# Altium schematic sheet DHT111_DHT11.schdoc
size 124 x 99 mm
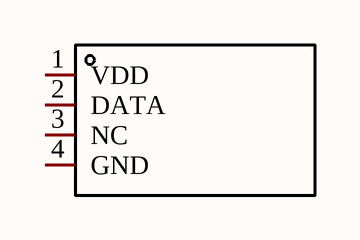
[diagram p0: DHT111_DHT11.schdoc]

## Parts
U?  DHT11  [SENSOR-TH_DHT11]  (value not drawn)

## Nets

Not connected (* = marked no-connect by the designer): U? 1(VDD) 2(DATA) 3(NC) 4(GND)

## Library data of the parts
U? = DHT11: Manufacturer: 广州奥松; Add into BOM: yes; Name: DHT11; Symbol: DHT11; Device: DHT11; LCSC Part Name: DHT11  电容式传感器; Supplier Part: C117051; Manufacturer Part: DHT11; Supplier Footprint: SIP-4; JLCPCB Part Class: Extended Part; Datasheet: https://atta.szlcsc.com/upload/public/pdf/source/20170703/1499081238365.pdf; Supplier: LCSC; Convert to PCB: yes